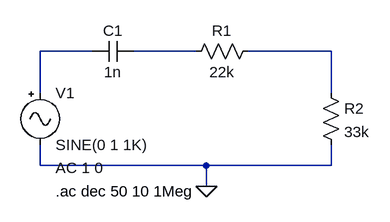
[diagram p0: schematic P4.asc]
P4.asc, the LTspice schematic file:
Version 4.1
SHEET 1 880 680
WIRE 128 80 48 80
WIRE 288 80 192 80
WIRE 496 80 368 80
WIRE 48 144 48 80
WIRE 496 144 496 80
WIRE 48 256 48 224
WIRE 304 256 48 256
WIRE 496 256 496 224
WIRE 496 256 304 256
WIRE 304 288 304 256
FLAG 304 288 0
SYMBOL Misc\\signal 48 128 R0
WINDOW 123 24 132 Left 2
WINDOW 39 0 0 Left 0
SYMATTR InstName V1
SYMATTR Value2 AC 1 0
SYMBOL cap 192 64 R90
WINDOW 0 0 32 VBottom 2
WINDOW 3 32 32 VTop 2
SYMATTR InstName C1
SYMATTR Value 1n
SYMBOL res 480 128 R0
SYMATTR InstName R2
SYMATTR Value 33k
SYMBOL res 384 64 R90
WINDOW 0 0 56 VBottom 2
WINDOW 3 32 56 VTop 2
SYMATTR InstName R1
SYMATTR Value 22k
TEXT 72 296 Left 2 !.ac dec 50 10 1Meg

The netlist it stands for:
* P4.asc
V1 N001 0 SINE(0 1 1K) AC 1 0
C1 N002 N001 1n
R2 N003 0 33k
R1 N003 N002 22k
.ac dec 50 10 1Meg
.backanno
.end